# EAGLE design rumpus (EAGLE 7.5.0)
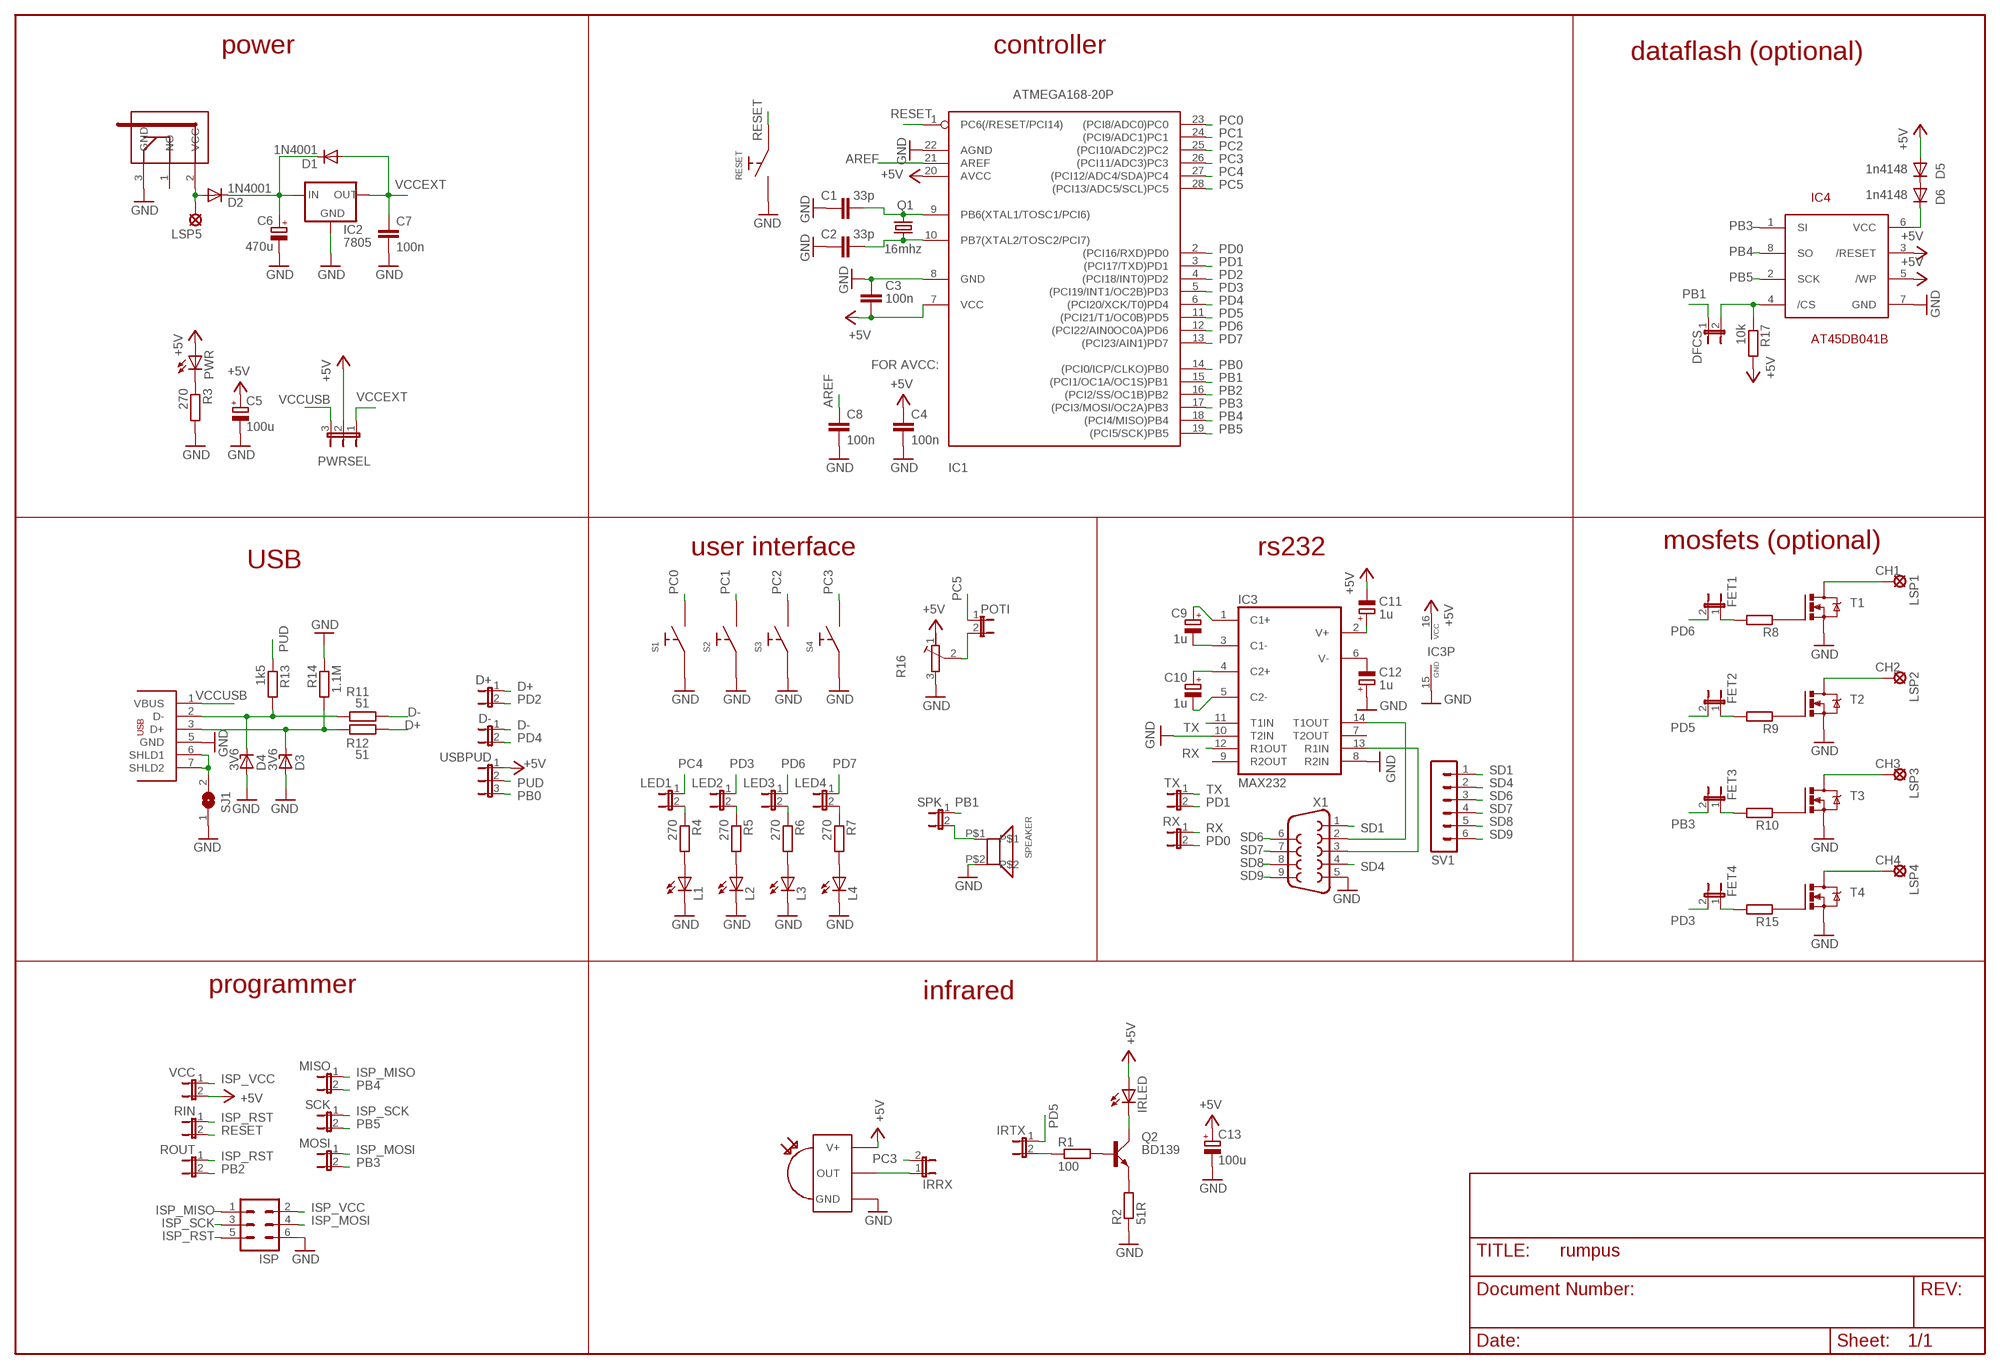
[diagram p0: schematic, sheet 1]

## Parts
C1  33p  C-EU025-024X044  [C025-024X044]
C2  33p  C-EU025-024X044  [C025-024X044]
C3  100n  C-EU025-024X044  [C025-024X044]
C4  100n  C-EU025-024X044  [C025-024X044]
C5  100u  CPOL-EUE2.5-6  [E2,5-6]
C6  470u  CPOL-EUE5-10.5  [E5-10,5]
C7  100n  C-EU025-024X044  [C025-024X044]
C8  100n  C-EU025-024X044  [C025-024X044]
C9  1u  CPOL-EUE2.5-6  [E2,5-6]
C10  1u  CPOL-EUE2.5-6  [E2,5-6]
C11  1u  CPOL-EUE2.5-6  [E2,5-6]
C12  1u  CPOL-EUE2.5-6  [E2,5-6]
C13  100u  CPOL-EUE2.5-6  [E2,5-6]
D1  1N4001  1N4004  [DO41-10]
D2  1N4001  1N4004  [DO41-10]
D3  3V6  ZENER-DIODEZD-2.5  [ZDIO-2.5]
D4  3V6  ZENER-DIODEZD-2.5  [ZDIO-2.5]
D5  1n4148  DIODE-D-2.5  [D-2.5]
D6  1n4148  DIODE-D-2.5  [D-2.5]
D+  JP1E  [JP1]
D-  JP1E  [JP1]
DFCS  JP1E  [JP1]
FET1  JP1E  [JP1]
FET2  JP1E  [JP1]
FET3  JP1E  [JP1]
FET4  JP1E  [JP1]
IC1  ATMEGA168-20P  [DIL28-3]
IC2  7805  78XXS  [78XXS]
IC3  MAX232  [DIL16]
IC4  AT45DB041B  [SOIC8]
IRLED  LED5MM  [LED5MM]
IRRX  JP1E  [JP1]
IRTX  JP1E  [JP1]
ISP  MA03-2  [MA03-2]
L1  LED3MM  [LED3MM]
L2  LED3MM  [LED3MM]
L3  LED3MM  [LED3MM]
L4  LED3MM  [LED3MM]
LED1  JP1E  [JP1]
LED2  JP1E  [JP1]
LED3  JP1E  [JP1]
LED4  JP1E  [JP1]
LSP1  LSP10  [LSP10]
LSP2  LSP10  [LSP10]
LSP3  LSP10  [LSP10]
LSP4  LSP10  [LSP10]
LSP5  LSP10  [LSP10]
MISO  JP1E  [JP1]
MOSI  JP1E  [JP1]
POTI  JP1E  [JP1]
PWR  LED3MM  [LED3MM]
PWRSEL  JP2E  [JP2]
Q1  16mhz  CRYTALHC49U-V  [HC49U-V]
Q2  BD139  [TO126AV]
R1  100  R-EU_0204/2V  [0204V]
R2  51R  R-EU_0204/2V  [0204V]
R3  270  R-EU_0204/7  [0204/7]
R4  270  R-EU_0204/2V  [0204V]
R5  270  R-EU_0204/2V  [0204V]
R6  270  R-EU_0204/2V  [0204V]
R7  270  R-EU_0204/2V  [0204V]
R8  R-EU_0204/2V  [0204V]
R9  R-EU_0204/2V  [0204V]
R10  R-EU_0204/2V  [0204V]
R11  51  R-EU_0204/2V  [0204V]
R12  51  R-EU_0204/2V  [0204V]
R13  1k5  R-EU_0204/2V  [0204V]
R14  1.1M  R-EU_0204/2V  [0204V]
R15  R-EU_0204/2V  [0204V]
R16  R-TRIMMPT6-L  [PT6-L]
R17  10k  R-EU_0204/2V  [0204V]
RESET  MIKROTASTER6X6L  [TASTER3301]
RIN  JP1E  [JP1]
ROUT  JP1E  [JP1]
RX  JP1E  [JP1]
S1  MIKROTASTER6X6L  [TASTER3301]
S2  MIKROTASTER6X6L  [TASTER3301]
S3  MIKROTASTER6X6L  [TASTER3301]
S4  MIKROTASTER6X6L  [TASTER3301]
SCK  JP1E  [JP1]
SJ1  SJ  [SJ]
SPEAKER  BUZZER  [BUZZER]
SPK  JP1E  [JP1]
SV1  MA06-1  [MA06-1]
T1  N-CHANNEL-MOSFET  [TO220BV]
T2  N-CHANNEL-MOSFET  [TO220BV]
T3  N-CHANNEL-MOSFET  [TO220BV]
T4  N-CHANNEL-MOSFET  [TO220BV]
TX  JP1E  [JP1]
U$2  TSOP1738  [TSOP17XX]
U$3  HEBW21  [HEBW21]
USB  USB-SOCKETMINI-B  [USB-BWM]
USBPUD  JP2E  [JP2]
VCC  JP1E  [JP1]
X1  F09HP  [F09HP]

## Nets
+5V: C3.2 C4.1 C5.+ C11.- C13.+ D5.A IC1.7(VCC) IC1.20(AVCC) IC3.16(VCC) IC4.3(/RESET) IC4.5(/WP) IRLED.A PWR.A PWRSEL.2 R16.1(A) R17.2 U$2.V+ USBPUD.1 VCC.2
AREF: C8.1 IC1.21(AREF)
CH1: LSP1.MP T1.D
CH2: LSP2.MP T2.D
CH3: LSP3.MP T3.D
CH4: LSP4.MP T4.D
D+: D+.1 R12.2
D-: D-.1 R11.2
GND: C1.2 C2.2 C3.1 C4.2 C5.- C6.- C7.2 C8.2 C12.+ C13.- D3.A D4.A IC1.8(GND) IC1.22(AGND) IC2.GND IC3.8(R2IN) IC3.10(T2IN) IC3.15(GND) IC4.7(GND) ISP.6 L1.K(C) L2.K(C) L3.K(C) L4.K(C) R2.1 R3.2 R14.1 R16.3(E) RESET.2 S1.1 S2.1 S3.1 S4.1 SJ1.1 SPEAKER.P$2 T1.S T2.S T3.S T4.S U$2.GND U$3.3(GND) USB.5(GND) X1.5
IR_OUT: IRTX.2 R1.1
ISP_MISO: ISP.1 MISO.1
ISP_MOSI: ISP.4 MOSI.1
ISP_RST: ISP.5 RIN.1 ROUT.1
ISP_SCK: ISP.3 SCK.1
ISP_VCC: ISP.2 VCC.1
N$1: D2.A LSP5.MP U$3.2(VCC)
N$2: PWR.K(C) R3.1
N$3: C1.1 IC1.9(PB6(XTAL1/TOSC1/PCI6)) Q1.1
N$4: C6.+ D1.C D2.C IC2.IN
N$5: C2.1 IC1.10(PB7(XTAL2/TOSC2/PCI7)) Q1.2
N$6: L1.A R4.2
N$7: L2.A R5.2
N$8: L3.A R6.2
N$9: L4.A R7.2
N$10: LED1.2 R4.1
N$11: LED2.2 R5.1
N$12: LED3.2 R6.1
N$13: SJ1.2 USB.6(SHLD1) USB.7(SHLD2)
N$14: D3.C R12.1 R14.2 USB.3(D+)
N$15: D4.C R11.1 R13.2 USB.2(D-)
N$16: LED4.2 R7.1
N$17: R8.1 T1.G
N$18: R9.1 T2.G
N$19: R10.1 T3.G
N$20: R15.1 T4.G
N$21: C9.+ IC3.1(C1+)
N$22: C9.- IC3.3(C1-)
N$23: C10.+ IC3.4(C2+)
N$24: C10.- IC3.5(C2-)
N$25: C11.+ IC3.2(V+)
N$26: C12.- IC3.6(V-)
N$27: IC3.13(R1IN) X1.3
N$28: IC3.14(T1OUT) X1.2
N$29: SPEAKER.P$1 SPK.2
N$30: IRRX.1 U$2.OUT
N$31: IRLED.K(C) Q2.C
N$32: Q2.E R2.2
N$33: Q2.B R1.2
N$34: FET1.1 R8.2
N$35: FET2.1 R9.2
N$36: FET3.1 R10.2
N$37: FET4.1 R15.2
N$44: POTI.2 R16.2(S)
N$57: D5.C D6.A
N$58: D6.C IC4.6(VCC)
N$59: DFCS.2 IC4.4(/CS) R17.1
PB0: IC1.14((PCI0/ICP/CLKO)PB0) USBPUD.3
PB1: DFCS.1 IC1.15((PCI1/OC1A/OC1S)PB1) SPK.1
PB2: IC1.16((PCI2/SS/OC1B)PB2) ROUT.2
PB3: FET3.2 IC1.17((PCI3/MOSI/OC2A)PB3) IC4.1(SI) MOSI.2
PB4: IC1.18((PCI4/MISO)PB4) IC4.8(SO) MISO.2
PB5: IC1.19((PCI5/SCK)PB5) IC4.2(SCK) SCK.2
PC0: IC1.23((PCI8/ADC0)PC0) S1.2
PC1: IC1.24((PCI9/ADC1)PC1) S2.2
PC2: IC1.25((PCI10/ADC2)PC2) S3.2
PC3: IC1.26((PCI11/ADC3)PC3) IRRX.2 S4.2
PC4: IC1.27((PCI12/ADC4/SDA)PC4) LED1.1
PC5: IC1.28((PCI13/ADC5/SCL)PC5) POTI.1
PD0: IC1.2((PCI16/RXD)PD0) RX.2
PD1: IC1.3((PCI17/TXD)PD1) TX.2
PD2: D+.2 IC1.4((PCI18/INT0)PD2)
PD3: FET4.2 IC1.5((PCI19/INT1/OC2B)PD3) LED2.1
PD4: D-.2 IC1.6((PCI20/XCK/T0)PD4)
PD5: FET2.2 IC1.11((PCI21/T1/OC0B)PD5) IRTX.1
PD6: FET1.2 IC1.12((PCI22/AIN0OC0A)PD6) LED3.1
PD7: IC1.13((PCI23/AIN1)PD7) LED4.1
PUD: R13.1 USBPUD.2
RESET: IC1.1(PC6(/RESET/PCI14)) RESET.1 RIN.2
RX: IC3.12(R1OUT) RX.1
SD1: SV1.1 X1.1
SD4: SV1.2 X1.4
SD6: SV1.3 X1.6
SD7: SV1.4 X1.7
SD8: SV1.5 X1.8
SD9: SV1.6 X1.9
TX: IC3.11(T1IN) TX.1
VCCEXT: C7.1 D1.A IC2.OUT PWRSEL.1
VCCUSB: PWRSEL.3 USB.1(VBUS)
Unconnected: IC3.7(T2OUT) IC3.9(R2OUT) U$3.1(NO)

## Notes on the sheet
- power | controller | dataflash (optional)
- FOR AVCC:
- user interface | rs232 | mosfets (optional)
- USB
- programmer | infrared

## Library data of the parts
C1-C4 C7 C8 = rcl:C-EU: CAPACITOR, European symbol
C5 C6 C9-C13 = rcl:CPOL-EU: POLARIZED CAPACITOR, European symbol
D1 D2 = diode:1N4004: DIODE general purpose rectifier, 1 A
D3 D4 = diode:ZENER-DIODE: Z-Diode
D5 D6 = diode:DIODE-: DIODE
D+ D- DFCS FET1-FET4 IRRX IRTX LED1-LED4 MISO MOSI POTI RIN ROUT RX SCK SPK TX VCC = small-jumper:JP1E: JUMPER
IC1 = avr:ATMEGA168*P: MICROCONTROLLER 16 kBytes FLASH 1 kBytes SRAM 512 Bytes EEPROM USART 8-channel 10 bit ADC
IC2 = v-reg:78XXS: VOLTAGE REGULATOR
IC3 = maxim:MAX232: RS232 TRANSEIVER
IC4 = atmel-dataflash:AT45DB041B
IRLED L1-L4 PWR = lemonhead-special:LED: LED OSRAM: - CHIPLED LG R971, LG N971, LY N971, LG Q971, LY Q971, LO R971, LY R971 LH N974, LH R974 LS Q976, LO Q976, LY Q976 LO Q996 - Hyper CHIPLED LW Q18S LB Q993, LB Q99A, LB R99A - SideLED LS A670, LO A670, LY A670, LG A670, LP A670 LB A673, LV A673, LT A673, LW A673 LH A674 LY A675 LS A676, LA A676, LO A676, LY A676, LW A676 LS A679, LY A679, LG A679 - Hyper Micro SIDELED® LS Y876, LA Y876, LO Y876, LY Y876 LT Y87S - SmartLED LW L88C, LW L88S LB L89C, LB L89S, LG L890 LS L89K, LO L89K, LY L89K LS L896, LA L896, LO L896, LY L896 - TOPLED LS T670, LO T670, LY T670, LG T670, LP T670 LSG T670, LSP T670, LSY T670, LOP T670, LYG T670 LG T671, LOG T671, LSG T671 LB T673, LV T673, LT T673, LW T673 LH T674 LS T676, LA T676, LO T676, LY T676, LB T676, LH T676, LSB T676, LW T676 LB T67C, LV T67C, LT T67C, LS T67K, LO T67K, LY T67K, LW E67C LS E67B, LA E67B, LO E67B, LY E67B, LB E67C, LV E67C, LT E67C LW T67C LS T679, LY T679, LG T679 LS T770, LO T770, LY T770, LG T770, LP T770 LB T773, LV T773, LT T773, LW T773 LH T774 LS E675, LA E675, LY E675, LS T675 LS T776, LA T776, LO T776, LY T776, LB T776 LHGB T686 LT T68C, LB T68C - Hyper Mini TOPLED® LB M676 - Mini TOPLED Santana® LG M470 LS M47K, LO M47K, LY M47K Source: http://www.osram.convergy.de/
ISP = isp-socket:MA03-2: PIN HEADER
LSP1-LSP5 = solpad:LSP10: SOLDER PAD drill 1.0 mm, distributor Buerklin, 12H555
PWRSEL USBPUD = small-jumper:JP2E: JUMPER
Q1 = crystal:CRYTAL: CRYSTAL
Q2 = transistor-power:BD139: NPN TRANSISTOR
R1-R15 R17 = rcl:R-EU_: RESISTOR, European symbol
R16 = hd44780-pin-header:R-TRIMM: Trimm resistor
RESET S1-S4 = hebw21-extern:MIKROTASTER
SJ1 = small-jumper:SJ: SMD solder JUMPER
SPEAKER = routerboard:BUZZER
SV1 = isp-socket:MA06-1: PIN HEADER
T1-T4 = mosfet-ansteuerung:N-CHANNEL-MOSFET
U$2 = tsop:TSOP1738: IR Receiver and Demodulator
U$3 = hebw21-extern:HEBW21
USB = unzap-misc:USB-SOCKET
X1 = subd09-extern:F09: SUB-D

## Board
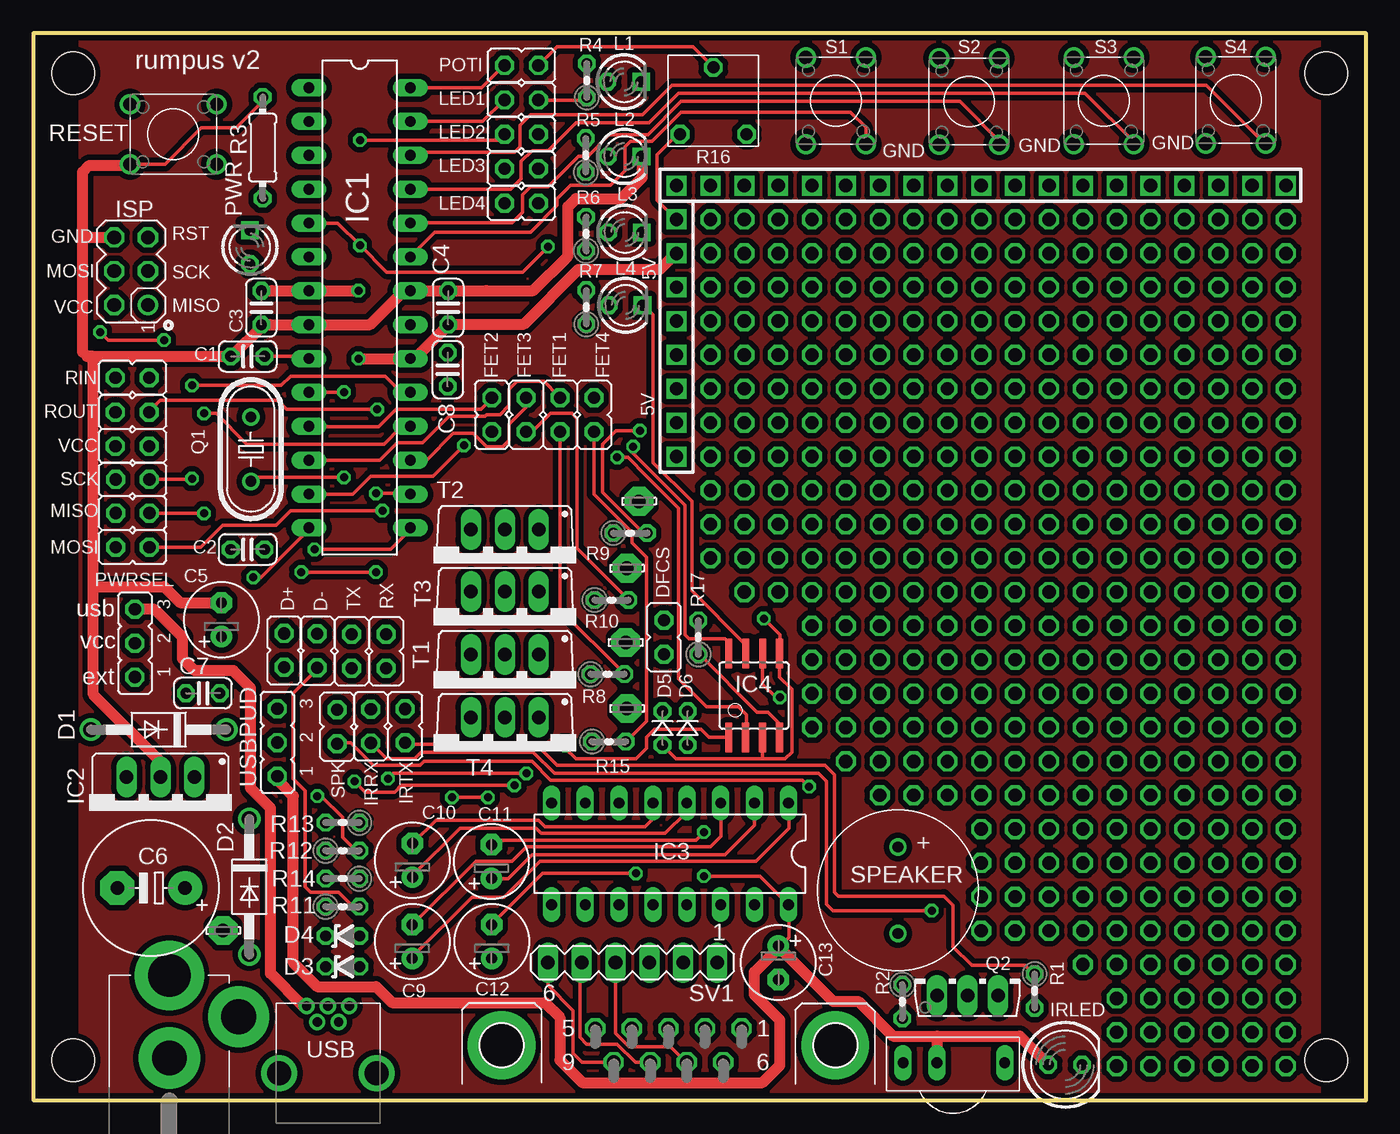
[diagram p1: board, top side]
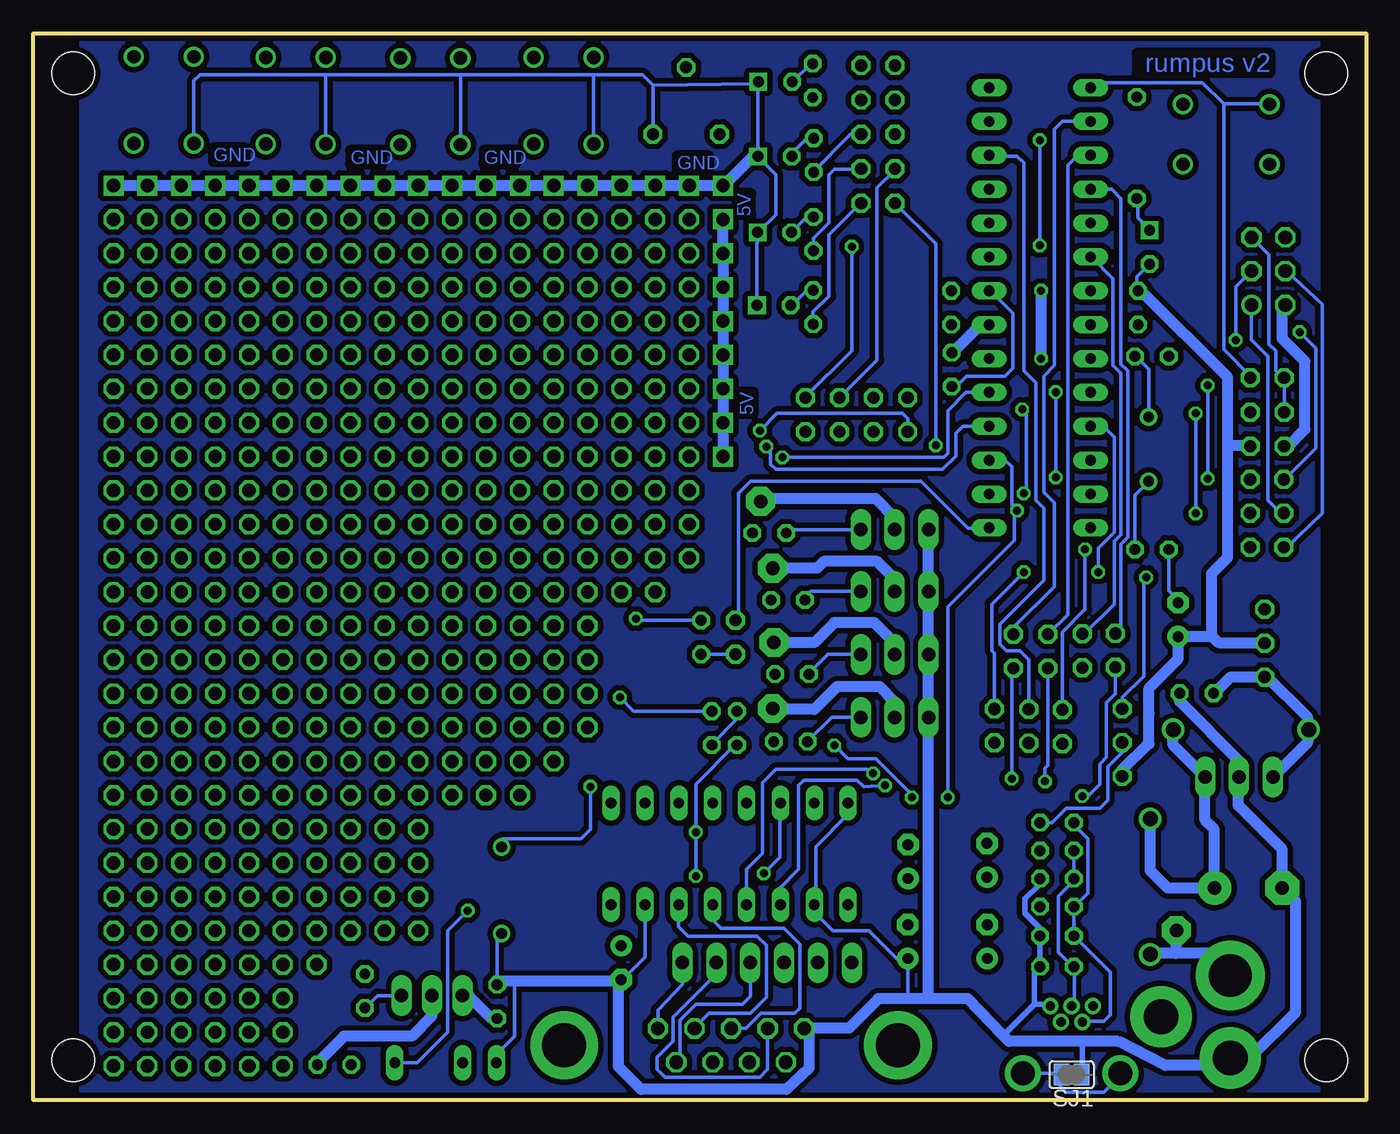
[diagram p2: board, bottom side, seen from below]

Size 100 x 80 mm. Coordinates in mm from the lower left corner, seen from the top.
Outline: 0,0 100,0 100,80 0,80 0,0
Copper layers (1*16): Top 0.035mm / dielectric 1.5mm / Bottom 0.035mm
Design rules "default": minimum track width 10mil, minimum drill 0.3mm, track to track 0.2mm, track to pad 0.2mm, pad to pad 0.2mm, via to via 0.2mm, smd to smd 0.15mm, copper to edge 0.2mm, drill to drill 0.3mm, minimum pad ring 10mil, minimum via ring 8mil, stop-mask expansion 4mil, vias tented up to drill 0mil, thermal gap 10mil
Holes 3.2 mm at 3,77 3,3 97,3 97,77
tRestrict: area 0,0 to 3,80; area 97,0 to 100,80
bRestrict: area 0,0 to 3,80; area 97,0 to 100,80
vRestrict: area 0,0 to 3,80; area 97,0 to 100,80

### Footprints (pad centres in the part's own frame; a part is rotated, then mirrored left to right if it is on the bottom)
C025-024X044 = drill 0.813 octagon: 1 -1.27,0; 2 1.27,0
E2,5-6 = drill 0.813 pad 1.6: + -1.27,0 | drill 0.813 pad 1.6 octagon: - 1.27,0
E5-10,5 = drill 1.016 pad 2.54: + -2.54,0 | drill 1.016 pad 2.54 octagon: - 2.54,0
DO41-10 = drill 1.118: A 5.08,0; C -5.08,0
ZDIO-2.5 = drill 0.813 octagon: A 1.27,0; C -1.27,0
D-2.5 = drill 0.813 octagon: A 1.27,0; C -1.27,0
JP1 = drill 0.914 octagon: 1 0,-1.27; 2 0,1.27
DIL28-3 = drill 0.813 long: 1 -16.51,-3.81; 2 -13.97,-3.81; 3 -11.43,-3.81; 4 -8.89,-3.81; 5 -6.35,-3.81; 6 -3.81,-3.81; 7 -1.27,-3.81; 8 1.27,-3.81; 9 3.81,-3.81; 10 6.35,-3.81; 11 8.89,-3.81; 12 11.43,-3.81; 13 13.97,-3.81; 14 16.51,-3.81; 15 16.51,3.81; 16 13.97,3.81; 17 11.43,3.81; 18 8.89,3.81; 19 6.35,3.81; 20 3.81,3.81; 21 1.27,3.81; 22 -1.27,3.81; 23 -3.81,3.81; 24 -6.35,3.81; 25 -8.89,3.81; 26 -11.43,3.81; 27 -13.97,3.81; 28 -16.51,3.81
78XXS = drill 1.016 long: GND 0,-2.54; IN -2.54,-2.54; OUT 2.54,-2.54
DIL16 = drill 0.813 long: 1 -8.89,-3.81; 2 -6.35,-3.81; 3 -3.81,-3.81; 4 -1.27,-3.81; 5 1.27,-3.81; 6 3.81,-3.81; 7 6.35,-3.81; 8 8.89,-3.81; 9 8.89,3.81; 10 6.35,3.81; 11 3.81,3.81; 12 1.27,3.81; 13 -1.27,3.81; 14 -3.81,3.81; 15 -6.35,3.81; 16 -8.89,3.81
SOIC8 = smd 0.5 x 2.2: 1 -1.905,-3.154; 2 -0.645,-3.154; 3 0.625,-3.154; 4 1.895,-3.154; 5 1.905,3.154; 6 0.635,3.154; 7 -0.635,3.154; 8 -1.905,3.154
LED5MM = drill 0.813 octagon: A -1.27,0; K 1.27,0
MA03-2 = drill 1.016: 1 -2.54,-1.27 | drill 1.016 octagon: 2 -2.54,1.27; 3 0,-1.27; 4 0,1.27; 5 2.54,-1.27; 6 2.54,1.27
LED3MM = drill 0.813 octagon: A -1.27,0 | drill 0.813 square: K 1.27,0
LSP10 = drill 1.016 pad 2.159 octagon: MP 0,0
JP2 = drill 0.914 octagon: 1 -2.54,0; 2 0,0; 3 2.54,0
HC49U-V = drill 0.813: 1 -2.413,0; 2 2.413,0
TO126AV = drill 1.016 long: B 2.286,-1.27; C 0,-1.27; E -2.286,-1.27
0204V = drill 0.813 octagon: 1 -1.27,0; 2 1.27,0
0204/7 = drill 0.813 octagon: 1 -3.81,0; 2 3.81,0
PT6-L = drill 0.9 octagon: 1 -2.5,-2.5; 2 0,2.5; 3 2.5,-2.5
TASTER3301 = drill 1: 1 -3.25,2.25; 2 -3.25,-2.25; 3 3.25,-2.25; 4 3.25,2.25
SJ = smd 1.168 x 1.6: 1 -0.762,0; 2 0.762,0
BUZZER = drill 0.8: P$1 -3.25,0; P$2 3.25,0
MA06-1 = drill 1.016 long: 1 -6.35,0; 2 -3.81,0; 3 -1.27,0; 4 1.27,0; 5 3.81,0; 6 6.35,0
TO220BV = drill 1.016 long: D 0,-2.54; G -2.54,-2.54; S 2.54,-2.54
TSOP17XX = drill 0.813 long: GND -3.81,0; OUT 3.81,0; V+ -1.27,0
HEBW21 = drill 2.6 pad 4.6: 1 0,-5.2; 3 -3.1,0 | drill 3.2 pad 5.2: 2 3.1,0
USB-BWM = drill 0.7: 1 5.05,1.6; 2 3.85,0.8; 3 5.05,0; 4 3.85,-0.8; 5 5.05,-1.6 | drill 1.8: 6 0,3.65; 7 0,-3.65
F09HP = drill 1.016 octagon: 1 -5.486,-1.27; 2 -2.743,-1.27; 3 0,-1.27; 4 2.743,-1.27; 5 5.486,-1.27; 6 -4.115,1.27; 7 -1.372,1.27; 8 1.372,1.27; 9 4.115,1.27 | drill 3.302 pad 5.08: G1 -12.522,0; G2 12.522,0

### Placement (x,y rotation side)
C1  16.08,55.77 180 top
C2  16.08,41.29 180 top
C3  17.11,59.42 90 top
C4  31.13,59.42 90 top
C5  14.11,36.02 90 top
C6  8.84,15.9 180 top
C7  12.72,30.51 0 top
C8  31.09,54.78 270 top
C9  28.43,11.88 90 top
C10  28.45,17.98 90 top
C11  34.37,17.88 90 top
C12  34.39,11.88 90 top
C13  55.9,10.3 270 top
D1  9.4,27.78 180 top
D2  16.2,16 270 top
D3  23.2,10 0 top
D4  23.2,12.3 0 top
D5  47.21,27.89 270 top
D6  49.09,27.89 270 top
D+  18.82,33.72 0 top
D-  21.3,33.7 0 top
DFCS  47.32,34.7 180 top
FET1  39.52,51.39 0 top
FET2  34.4,51.39 0 top
FET3  36.98,51.39 0 top
FET4  42.06,51.39 0 top
IC1  24.48,59.42 270 top
IC2  9.54,21.68 180 top
IC3  47.76,18.46 180 top
IC4  54.08,30.34 0 top
IRLED  77.42,2.64 0 top
IRRX  25.32,28.04 0 top
IRTX  27.9,28.06 180 top
ISP  7.34,62.16 90 top
L1  44.33,76.37 0 top
L2  44.36,70.77 0 top
L3  44.39,65.07 0 top
L4  44.44,59.61 0 top
LED1  36.62,75 270 top
LED2  36.62,72.42 270 top
LED3  36.62,69.84 270 top
LED4  36.62,67.26 270 top
LSP1  44.44,34.32 0 top
LSP2  45.44,44.9 0 top
LSP3  44.54,39.88 0 top
LSP4  44.54,29.36 0 top
LSP5  14.24,12.72 0 top
MISO  7.44,44.02 270 top
MOSI  7.44,41.46 270 top
POTI  36.62,77.59 270 top
PWR  16.25,63.96 90 top
PWRSEL  7.62,34.26 90 top
Q1  16.32,48.81 270 top
Q2  70.09,9.1 0 top
R1  75.12,8.18 270 top
R2  65.2,7.38 270 top
R3  17.21,71.42 90 top
R4  41.53,76.46 90 top
R5  41.45,70.86 90 top
R6  41.47,64.96 90 top
R7  41.49,59.46 90 top
R8  43.08,31.94 0 top
R9  44.78,42.52 0 top
R10  43.38,37.5 0 top
R11  23.2,14.5 0 top
R12  23.2,18.7 0 top
R13  23.2,20.8 180 top
R14  23.2,16.6 180 top
R15  43.18,26.88 0 top
R16  51.02,74.94 0 top
R17  49.9,34.7 90 top
RESET  10.5,72.43 0 top
RIN  7.43,54.16 270 top
ROUT  7.43,51.58 270 top
RX  26.46,33.66 0 top
S1  60.21,74.94 90 top
S2  70.21,74.89 90 top
S3  80.31,74.94 90 top
S4  90.21,74.99 90 top
SCK  7.44,46.54 270 top
SJ1  22.1,1.9 180 bottom
SPEAKER  64.87,15.73 270 top
SPK  22.8,28 180 top
SV1  44.95,10.3 180 top
T1  35.38,30.88 180 top
T2  35.38,40.24 180 top
T3  35.38,35.6 180 top
T4  35.38,26.16 180 top
TX  23.88,33.66 0 top
U$2  69.07,2.79 0 top
U$3  10.2,6.24 90 top
USB  22.1,2 90 top
USBPUD  18.31,26.81 90 top
VCC  7.43,49.04 270 top
X1  47.65,4.1 180 top

### Tracks (layer width: path | path; a pad name or v marks a point on that pad's centre or on a via)
+5V  (via drill 0.6, 1)
  Top 0.254: C11.- 34.37,19.17 34.7,19.5 49.7,19.5 v50.3,20.1 | v50.3,16.8 54.5,16.8 IC3.16 56.7,14.6 56.7,12.2 56,11.5 | R16.1 48.34,72.44 46.8,70.9 46.8,67.5 v48.26,66.04 48.3,66 | IC4.3 | IC4.3 54.7,27.9 | D5.A 47.21,26.6 47.2,26.6 48.2,25.6 54.7,25.6 | 54.7,25.6 56.4,25.6 56.9,26.1 56.9,30.8 55.98,31.71 IC4.5 55.98,33.6 56,33.6 56,34.9 v54.8,36.1 | 54.7,25.6 IC4.3
  Top 0.813: USBPUD.1 18.37,23.93 19.5,22.8 19.5,10.3 21.3,8.5 25.7,8.5 26.9,7.3 38.4,7.3 39.5,6.2 39.5,3 41.2,1.3 54.7,1.3 56,2.6 56,6 54.1,7.9 54.1,9.6 55.9,11.4 C13.+ | C13.+ 55.93,11.37 56,11.5 55.97,11.47 C13.+ | C13.+ 55.93,11.47 | IRLED.A 74,4.8 67.8,4.8 | 67.8,4.8 U$2.V+ | 17.9,60.7 17.89,60.69 C3.2 20.49,60.69 20.5,60.7 20.51,60.69 IC1.7 v24.39,60.69 v24.4,60.7 | v24.4,55.6 IC1.20 28.61,55.61 31.15,58.15 | 31.15,58.15 31.2,58.2 | 31.15,58.15 C4.1 31.13,58.2 | 31.13,58.2 31.1,58.2 | v48.26,63.5 48.26,63.6 48.3,63.6 47,62.3 40.9,62.3 36.8,58.2 31.13,58.2 | C13.+ 55.9,11.5 60,7.4 61.9,7.4 64.5,4.8 67.8,4.8
  Bottom 0.254: 16.3,29 16.45,28.85 | v50.3,16.8 v50.3,20.1 50.3,23.7 47.4,26.6 47.4,26.62 D5.A | R17.2 54.67,35.97 v54.8,36.1 | C3.2 17.2,60.7 17.2,61.74 PWR.A
  Bottom 0.813: USBPUD.1 18.3,24.79 18.3,24.8 16.4,26.7 16.3,26.7 16.3,29 16.3,30.9 14.1,33.1 14.1,34.8 14.11,34.8 C5.+ | 14,34.8 C5.+ | PWRSEL.2 7.7,34.26 7.7,34.3 11.1,34.3 11.6,34.8 | 14,34.8 14.05,34.75 C5.+ | 14,34.8 11.6,34.8 | 8.7,49.1 VCC.2 | 8.7,49.1 8.8,49 | 11.6,34.8 11.6,39.5 10.4,40.7 10.4,49.1 | 10.4,49.1 10.4,54.2 16.89,60.69 C3.2 | 10.4,49.1 8.7,49.1 | v24.4,60.7 v24.4,55.6 | v48.26,66.04 v48.26,63.5 v48.26,60.96 v48.26,58.42 v48.26,55.88 v48.26,53.34 v48.26,50.8 v48.26,48.26
AREF
  Bottom 0.813: 31.09,56.01 31.1,56 | 31.09,56.01 C8.1 | IC1.21 28.95,58.15 31.09,56.01
CH1
  Bottom 0.813: T1.D 35.38,34.28 36.9,35.8 39.9,35.8 41.4,34.3 44.5,34.3 44.48,34.32 LSP1.MP
CH2
  Bottom 0.813: T2.D 35.38,43.68 36.8,45.1 44.7,45.1 45.3,44.9 LSP2.MP
CH3
  Bottom 0.813: T3.D 35.38,39.08 36.7,40.4 40.7,40.4 41.2,39.9 44.4,39.9 44.42,39.88 LSP3.MP
CH4
  Bottom 0.813: T4.D 35.38,29.88 36.5,31 39.7,31 41.4,29.3 44.4,29.3 44.5,29.4 LSP4.MP
D+  (via drill 0.6)
  Top 0.254: R12.2 24.2,18.7 23.2,19.7 23.2,21.2 21.6,22.8 v21.3,22.8
  Bottom 0.254: D+.1 18.82,30.48 19.5,29.8 19.5,25.7 20,25.2 20,23.7 20.9,22.8 v21.3,22.8
D-
  Top 0.254: R11.2 24,14.5 22.9,15.6 20.8,15.6 20.4,16 20.4,23.2 19.5,24.1 19.5,30.5 21.3,32.3 D-.1
GND  (via drill 1)
  Top 0.254: RESET.2 9.88,70.18 12.6,72.9 15.2,72.9 17.03,74.73 | 17.03,74.73 17.1,74.8 | 17.03,74.73 R3.2 | IC4.7 53.45,34.16 49.4,38.2 49.4,44.9 46.5,47.8 46.5,58.9 45.8,59.6 45.8,59.61 L4.K
  Top 0.813: IC2.GND 9.54,25.36 4.5,30.4 4.5,38.5 | C5.- 13.9,37.29 13.9,37.3 11,37.3 9.8,38.5 4.5,38.5 | 3.7,64.7 3.7,56.1 4.03,55.77 4.5,55.77 | 3.7,64.7 3.7,69.6 4.2,70.1 7.2,70.1 7.28,70.28 RESET.2 | 3.7,64.7 ISP.6 | 4.5,55.77 14.87,55.77 | 4.5,38.5 4.5,55.77 | 14.87,55.77 C1.2 | 14.87,55.77 17.3,58.2 17.75,58.15 C3.1 20.55,58.15 20.6,58.1 20.65,58.15 IC1.8 25.25,58.15 27.8,60.7 28.21,60.69 IC1.22 30.99,60.69 31,60.7 31.01,60.69 C4.2 33.99,60.69 33.99,60.7 37.5,60.7 40.1,63.3 40.1,67 40.7,67.6 44.1,67.6 45.7,69.2 45.7,70.7 45.63,70.8 L2.K | L4.K
  Bottom 0.254: D4.A 24.5,12.3 24.47,12.27 | 21.3,2.5 21.44,2.3 SJ1.1 | 24.5,9.9 24.47,9.9 D3.A | 42.16,5.4 42.1,5.3 | 34.5,7.6 34.39,7.71 C12.+ 35.21,10.61 37.3,12.7 40,12.7 41.4,14.1 41.4,14.6 41.41,14.6 IC3.10 41.3,14.7 41.3,19 38.87,21.43 IC3.8 | C5.- 14.01,37.29 14,37.3 14.81,38.21 C2.2 | C8.2 30.79,53.51 30,54.3 27.1,54.3 26.5,54.9 26.5,59 28.2,60.7 28.21,60.69 IC1.22 | L4.K 45.71,64.29 45.66,64.34 L3.K 45.63,65.07 44.3,66.4 44.3,69.4 45.6,70.7 45.63,70.7 L2.K | L2.K 45.73,70.47 45.8,70.4 45.66,70.26 | L1.K 45.6,76.3 45.63,76.27 L2.K | L2.K 45.63,70.53 45.8,70.7 | S4.1 87.96,76.44 87.5,76.9 78.1,76.9 | 45.7,76.3 45.67,76.27 L1.K | 57.9,76.9 67.9,76.9 | 67.9,76.9 78.1,76.9 | S1.1 57.96,76.84 57.9,76.9 | S2.1 67.96,76.84 67.9,76.9 | S3.1 78.06,76.86 78.1,76.9 | L1.K 45.67,76.37 | v53.34,68.58 53.42,68.58 53.5,68.5 53.52,68.52 | 45.7,76.3 45.63,76.37 L1.K | 45.7,76.3 45.8,76.2 53.5,76.1 | 57.9,76.9 54.3,76.9 53.5,76.1 | R16.3 53.52,76.08 53.5,76.1 | C13.- 55.9,8.9 54.11,10.69 IC3.15 | U$2.GND 65.26,3.44 63.9,4.8 63.9,8.9 | SPEAKER.P$2 65.2,12.15 65.2,8.7
  Bottom 0.406: D3.A 24.47,12.27 | 24.5,9.9 24.9,9.5 24.9,7.2 | D4.A 24.47,12.87 25.6,14 25.6,15.1 24.5,16.2 R14.1 | 21.3,4.4 21.3,2.5 | 33.8,7.6 33.8,7.8 33.81,7.81 | 27.25,4.85 27.25,4.9 27.3,4.8 24.9,7.2 | USB.5 23.7,7 23.9,7.2 24.9,7.2
  Bottom 0.813: C7.2 13.99,30.4 13.9,30.3 14,30.2 14,29.9 9.4,25.3 9.4,24.3 9.5,24.2 9.5,24.22 IC2.GND 9.54,24.1 9.5,24.1 9.6,24 9.6,22.1 6.3,18.8 C6.- 5.3,14.9 5.3,6.6 8.76,3.14 U$3.3 10.74,2.6 15.1,2.6 18.6,4.4 21.3,4.4 26.8,4.4 27.25,4.85 29.9,7.6 32.8,7.6 | 42,5.5 42.1,5.37 X1.5 | X1.5 42.16,5.4 38.8,5.4 36.6,7.6 34.5,7.6 33.8,7.6 32.8,7.6 | X1.5 42.16,5.3 42.2,5.3 41.8,4.9 41.8,2.4 43.5,0.8 54.4,0.8 56.1,2.5 56.1,8.9 | C13.- 55.87,8.93 55.9,8.9 56.1,8.9 | C13.- 55.9,9 55.89,9.01 | 32.8,7.6 32.84,7.64 T4.S T1.S | T1.S 32.84,33.56 32.8,33.6 | T1.S T3.S | T3.S 32.84,38.16 32.8,38.2 | 32.84,42.86 T2.S | T3.S 32.84,42.86 | 32.84,42.86 32.8,42.9 | v93.98,68.58 v91.44,68.58 v88.9,68.58 v86.36,68.58 v83.82,68.58 v81.28,68.58 v78.74,68.58 v76.2,68.58 v73.66,68.58 v71.12,68.58 v68.58,68.58 v66.04,68.58 v63.5,68.58 v60.96,68.58 v58.42,68.58 v55.88,68.58 v53.34,68.58 v50.8,68.58 v48.26,68.58 48.22,68.58 46.1,70.7 46,70.77 L2.K | 56.1,8.9 56.1,8.93 C13.- | R2.1 65.2,8.7 65.2,8.8 65.1,8.9 63.9,8.9 56.1,8.9
IR_OUT
  Top 0.254: R1.1 75.05,9.45 74.4,10.1 70.4,10.1 69,11.5 69,14.6 68.3,15.3 60.4,15.3 60.1,15.6 60.1,24.4 59.4,25.1 39.3,25.1 37.7,26.7 27.8,26.7 IRTX.2
ISP_MISO
  Bottom 0.254: ISP.1 8.61,57.01 7.4,55.8 7.4,45 6.3,43.9 6.28,43.92 MISO.1
ISP_MOSI
  Bottom 0.254: ISP.4 5.96,62.16 3.3,59.7 3.3,44 6.1,41.3 6.16,41.36 MOSI.1
ISP_RST
  Bottom 0.254: ISP.5 7.3,63.39 7.3,56.7 6.8,56.2 6.8,54.7 6.2,54.1 | 6.2,54.1 6.16,54.14 RIN.1 | ROUT.1 6.16,54.06 6.2,54.1
ISP_SCK  (via drill 0.6)
  Top 0.254: v9.8,57 5.6,57 v5,57.6
  Bottom 0.254: ISP.3 8.64,62.16 9.8,61 v9.8,57 | 6.2,46.4 6.17,46.43 SCK.1 6.17,46.47 6.2,46.5 3.8,48.9 3.8,56.4 v5,57.6
ISP_VCC
  Bottom 0.813: VCC.1 5.86,49.04 4.6,50.3 4.6,55.4 6.3,57.1 6.3,59.2 6,59.5 6.07,59.57 ISP.2
N$1
  Bottom 0.813: 16.2,10.9 D2.A 16.2,11 14.3,11 | U$3.2 11.86,11 14.3,11 | LSP5.MP 14.24,11.06 14.3,11
N$2
  Bottom 0.254: PWR.K 17.15,66.15 17.15,67.65 17.3,67.8 17.29,67.81 R3.1
N$3
  Top 0.254: IC1.9 20.67,55.67 20.7,55.7 20.63,55.77 C1.1
  Bottom 0.254: C1.1 17.33,55.77 17.3,55.8 16.32,54.82 Q1.1
N$4
  Bottom 0.813: D2.C 16.2,17.2 14.9,15.9 C6.+ 11.3,15.8 11.4,15.9 11.4,20.3 12.1,21 12.1,24.3 12.08,24.3 IC2.IN 14.5,26.64 14.5,27.8 D1.C
N$5  (via drill 0.6)
  Top 0.254: IC1.10 22.97,53.07 v23.3,53.1 | Q1.2 16.4,46.4 16.7,46.7 v23.3,46.7
  Bottom 0.254: v23.3,46.7 v23.3,53.1 | Q1.2 16.32,46.38 17.35,45.35 C2.1
N$6
  Bottom 0.254: L1.A 43.03,76.37 41.67,77.73 R4.2
N$7
  Bottom 0.254: L2.A 43.09,70.79 43.2,70.9 41.97,72.13 R5.2
N$8
  Bottom 0.254: L3.A 41.97,66.23 R6.2
N$9
  Bottom 0.254: L4.A 43.11,59.61 43.1,59.6 41.97,60.73 R7.2
N$10
  Top 0.254: R4.1 41.53,75.1 41.5,75.1 41.4,75 LED1.2
N$11
  Bottom 0.254: R5.1 41.5,69.59 41.5,69.6 38.68,72.42 LED2.2
N$12
  Bottom 0.254: R6.1 41.47,64.63 40.3,65.8 40.3,69.4 39.9,69.8 37.9,69.8 37.8,69.9 LED3.2
N$13
  Bottom 0.254: 23.2,1.9 SJ1.2 23.3,2 | 23.3,2 USB.7 | USB.6 18.3,2 19.7,0.6 22.5,0.6 23.2,1.3 23.2,1.9 | 23.2,1.9 23.3,2
N$14
  Bottom 0.254: R12.1 21.9,18.7 21.93,18.67 R14.2 21.9,16.5 23.1,15.3 23.1,11.1 22,10 D3.C 21.93,9.9 21.9,9.9 21.9,7.4 22.15,7.05 USB.3
N$15
  Bottom 0.254: D4.C 22,12.3 | D4.C 21.93,14.37 21.9,14.4 21.93,14.4 R11.1 21.9,14.5 20.9,15.5 20.9,19.6 21.93,20.63 R13.2 | USB.2 21.7,5.9 19.7,5.9 19.2,6.4 19.2,9.6 21.9,12.3 D4.C
N$16
  Bottom 0.254: R7.1 41.49,59.11 40.3,60.3 40.3,64.9 37.9,67.3 37.89,67.3 LED4.2
N$17
  Bottom 0.254: R8.1 41.81,31.99 40.38,33.42 T1.G
N$18
  Bottom 0.254: R9.1 43.51,42.5 43.5,42.5 43.22,42.78 T2.G
N$19
  Bottom 0.254: R10.1 42.11,37.69 41.66,38.14 T3.G
N$20
  Bottom 0.254: R15.1 40.1,28.7 T4.G
N$21
  Top 0.254: C9.+ 28.43,10.73 32.9,15.2 35.3,15.2 38,17.9 54.2,17.9 56.7,20.4 56.7,22.2 56.65,22.25 IC3.1 56.67,22.27 56.7,22.3
N$22
  Top 0.254: IC3.3 51.57,21.27 51.6,21.3 51.6,19.8 50.8,19 37,19 35.9,17.9 33.2,17.9 28.43,13.13 | 28.43,13.13 28.4,13.1 | C9.- 28.43,13.13
N$23
  Top 0.254: C10.+ 28.45,16.85 32,20.4 37.7,20.4 38.1,20 47.4,20 49,21.6 49,22.2 49.03,22.23 IC3.4
N$24
  Top 0.254: IC3.5 46.49,22.21 46.5,22.2 46.5,21.1 45.9,20.5 38.4,20.5 37.9,21 30.2,21 C10.-
N$25
  Top 0.254: C11.+ 34.39,16.61 34.4,16.6 35.6,16.6 37.4,18.4 51.9,18.4 54.1,20.6 54.1,21.3 54.11,21.31 IC3.2
N$26  (via drill 0.6)
  Top 0.254: C12.- 34.39,13.19 38.2,17 v45.2,17
  Bottom 0.254: IC3.6 43.95,22.25 44,22.2 44,18.2 v45.2,17
N$27
  Bottom 0.254: IC3.13 48.95,14.65 48.9,14.6 49,14.5 49,13.5 48.4,12.9 43.7,12.9 42.5,11.7 42.5,6.9 42.9,6.5 45.4,6.5 46.53,5.37 X1.3
N$28
  Bottom 0.254: IC3.14 51.57,14.53 51.6,14.5 51.6,13 50.9,12.3 45.7,12.3 45,11.6 45,7.7 46.2,6.5 49.3,6.5 50.4,5.4 50.39,5.4 X1.2
N$29  (via drill 0.6)
  Top 0.254: v58.2,23.5 57.7,24 38.8,24 37.4,25.4 29.3,25.4 29,25.1 25.5,25.1 23.8,26.8 23,26.8 22.9,26.7 22.87,26.73 SPK.2
  Bottom 0.254: 22.9,26.8 22.83,26.73 SPK.2 | v58.2,23.5 58.2,20.3 58.9,19.6 64.8,19.6 SPEAKER.P$1 64.9,19.5
N$30  (via drill 0.6)
  Top 0.254: v67.4,14.2 60,14.2 59.5,14.7 59.5,23.9 58.9,24.5 39.1,24.5 37.5,26.1 29.1,26.1 28.6,25.6 26.5,25.6 IRRX.1 | 25.3,26.7 25.32,26.72 IRRX.1 | IRRX.1 25.3,26.8
  Bottom 0.254: v67.4,14.2 68.9,12.7 68.9,5.1 71.2,2.8 72.9,2.8 73,2.7 72.9,2.79 U$2.OUT
N$31
  Bottom 0.813: Q2.C 70.09,6.31 71.6,4.8 76.7,4.8 78.8,2.7 78.49,2.69 IRLED.K
N$32
  Bottom 0.813: Q2.E 67.27,7.83 67.3,7.8 65.61,6.11 R2.2
N$33
  Bottom 0.254: R1.2 75.1,6.9 74.17,7.83 Q2.B
N$34
  Top 0.254: R8.2 44.35,32 44.3,32 39.52,36.78 FET1.1
N$35  (via drill 0.6)
  Top 0.254: 45.9,42.52 45.9,42.5 | 45.9,42.52 45.6,42.7 42.7,45.6 42.7,49.2 43.7,50.2 v45.5,50.2 | 45.9,42.52 R9.2
  Bottom 0.254: FET2.1 34.4,51.1 34.8,51.5 44.2,51.5 v45.5,50.2
N$36
  Top 0.254: FET3.1 37.42,50.12 38.8,51.5 40.4,51.5 40.8,51.1 40.8,41.4 44.7,37.5 R10.2
N$37
  Top 0.254: FET4.1 42.06,45.44 44.9,42.6 44.9,41.8 46,40.7 46,28.4 44.5,26.9 44.5,26.88 R15.2
N$38  (via drill 1)
  other vias: 63.5,66.04
N$39  (via drill 1)
  other vias: 66.04,66.04
N$40  (via drill 1)
  other vias: 68.58,66.04
N$41  (via drill 1)
  other vias: 71.12,66.04
N$42  (via drill 1)
  other vias: 73.66,66.04
N$43  (via drill 1)
  other vias: 76.2,66.04
N$44
  Top 0.254: POTI.2 39.3,79 49.5,79 51,77.5 51.02,77.5 R16.2
N$45  (via drill 1)
  other vias: 50.8,66.04
N$46  (via drill 1)
  other vias: 53.34,66.04
N$47  (via drill 1)
  other vias: 55.88,66.04
N$48  (via drill 1)
  other vias: 58.42,66.04
N$49  (via drill 1)
  other vias: 60.96,66.04
N$50  (via drill 1)
  other vias: 78.74,66.04
N$51  (via drill 1)
  other vias: 81.28,66.04
N$52  (via drill 1)
  other vias: 83.82,66.04
N$53  (via drill 1)
  other vias: 86.36,66.04
N$54  (via drill 1)
  other vias: 88.9,66.04
N$55  (via drill 1)
  other vias: 91.44,66.04
N$56  (via drill 1)
  other vias: 93.98,66.04
N$57
  Bottom 0.254: D6.A 49.09,26.7 49.1,26.7 47.21,28.59 D5.C
N$58  (via drill 0.6)
  Top 0.254: v56,30.2 55.7,30.2 54.7,31.2 54.7,33.4 54.72,33.4 IC4.6
  Bottom 0.254: D6.C 54.96,29.16 v56,30.2
N$59
  Top 0.254: R17.1 49.97,33.43 54.3,29.1 55.1,29.1 56,28.2 56,27.19 IC4.4
  Bottom 0.254: R17.1 49.9,33.5 49.83,33.43 DFCS.2
N$60  (via drill 1)
  other vias: 50.8,43.18
N$61  (via drill 1)
  other vias: 50.8,40.64
N$62  (via drill 1)
  other vias: 50.8,63.5
N$63  (via drill 1)
  other vias: 53.34,63.5
N$64  (via drill 1)
  other vias: 55.88,63.5
N$65  (via drill 1)
  other vias: 58.42,63.5
N$66  (via drill 1)
  other vias: 60.96,63.5
N$67  (via drill 1)
  other vias: 63.5,63.5
N$68  (via drill 1)
  other vias: 66.04,63.5
N$69  (via drill 1)
  other vias: 68.58,63.5
N$70  (via drill 1)
  other vias: 71.12,63.5
N$71  (via drill 1)
  other vias: 73.66,63.5
N$72  (via drill 1)
  other vias: 76.2,63.5
N$73  (via drill 1)
  other vias: 78.74,63.5
N$74  (via drill 1)
  other vias: 81.28,63.5
N$75  (via drill 1)
  other vias: 83.82,63.5
N$76  (via drill 1)
  other vias: 86.36,63.5
N$77  (via drill 1)
  other vias: 88.9,63.5
N$78  (via drill 1)
  other vias: 91.44,63.5
N$79  (via drill 1)
  other vias: 93.98,63.5
N$81  (via drill 1)
  other vias: 50.8,60.96
N$82  (via drill 1)
  other vias: 53.34,60.96
N$83  (via drill 1)
  other vias: 55.88,60.96
N$84  (via drill 1)
  other vias: 58.42,60.96
N$85  (via drill 1)
  other vias: 60.96,60.96
N$86  (via drill 1)
  other vias: 63.5,60.96
N$87  (via drill 1)
  other vias: 66.04,60.96
N$88  (via drill 1)
  other vias: 71.12,60.96
N$89  (via drill 1)
  other vias: 68.58,60.96
N$90  (via drill 1)
  other vias: 73.66,60.96
N$91  (via drill 1)
  other vias: 76.2,60.96
N$92  (via drill 1)
  other vias: 78.74,60.96
N$93  (via drill 1)
  other vias: 81.28,60.96
N$94  (via drill 1)
  other vias: 83.82,60.96
N$95  (via drill 1)
  other vias: 86.36,60.96
N$96  (via drill 1)
  other vias: 88.9,60.96
N$97  (via drill 1)
  other vias: 91.44,60.96
N$98  (via drill 1)
  other vias: 93.98,60.96
N$100  (via drill 1)
  other vias: 53.34,58.42
N$101  (via drill 1)
  other vias: 50.8,58.42
N$102  (via drill 1)
  other vias: 55.88,58.42
N$103  (via drill 1)
  other vias: 58.42,58.42
N$104  (via drill 1)
  other vias: 60.96,58.42
N$105  (via drill 1)
  other vias: 63.5,58.42
N$106  (via drill 1)
  other vias: 68.58,58.42
N$107  (via drill 1)
  other vias: 66.04,58.42
N$108  (via drill 1)
  other vias: 71.12,58.42
N$109  (via drill 1)
  other vias: 73.66,58.42
N$110  (via drill 1)
  other vias: 76.2,58.42
N$111  (via drill 1)
  other vias: 78.74,58.42
N$112  (via drill 1)
  other vias: 81.28,58.42
N$113  (via drill 1)
  other vias: 83.82,58.42
N$114  (via drill 1)
  other vias: 86.36,58.42
N$115  (via drill 1)
  other vias: 88.9,58.42
N$116  (via drill 1)
  other vias: 91.44,58.42
N$117  (via drill 1)
  other vias: 93.98,58.42
N$119  (via drill 1)
  other vias: 50.8,55.88
N$120  (via drill 1)
  other vias: 53.34,55.88
N$121  (via drill 1)
  other vias: 55.88,55.88
N$122  (via drill 1)
  other vias: 58.42,55.88
N$123  (via drill 1)
  other vias: 60.96,55.88
N$124  (via drill 1)
  other vias: 63.5,55.88
N$125  (via drill 1)
  other vias: 66.04,55.88
N$126  (via drill 1)
  other vias: 68.58,55.88
N$127  (via drill 1)
  other vias: 71.12,55.88
N$128  (via drill 1)
  other vias: 73.66,55.88
N$129  (via drill 1)
  other vias: 78.74,55.88
N$130  (via drill 1)
  other vias: 76.2,55.88
N$131  (via drill 1)
  other vias: 81.28,55.88
N$132  (via drill 1)
  other vias: 86.36,55.88
N$133  (via drill 1)
  other vias: 83.82,55.88
N$134  (via drill 1)
  other vias: 88.9,55.88
N$135  (via drill 1)
  other vias: 91.44,55.88
N$136  (via drill 1)
  other vias: 93.98,55.88
N$153  (via drill 1)
  other vias: 53.34,53.34
N$154  (via drill 1)
  other vias: 55.88,53.34
N$155  (via drill 1)
  other vias: 58.42,53.34
N$156  (via drill 1)
  other vias: 60.96,53.34
N$157  (via drill 1)
  other vias: 63.5,53.34
N$158  (via drill 1)
  other vias: 66.04,53.34
N$159  (via drill 1)
  other vias: 68.58,53.34
N$160  (via drill 1)
  other vias: 71.12,53.34
N$161  (via drill 1)
  other vias: 53.34,50.8
N$162  (via drill 1)
  other vias: 55.88,50.8
N$163  (via drill 1)
  other vias: 58.42,50.8
N$164  (via drill 1)
  other vias: 60.96,50.8
N$165  (via drill 1)
  other vias: 63.5,50.8
N$166  (via drill 1)
  other vias: 66.04,50.8
N$167  (via drill 1)
  other vias: 68.58,50.8
N$168  (via drill 1)
  other vias: 71.12,50.8
N$169  (via drill 1)
  other vias: 53.34,48.26
N$170  (via drill 1)
  other vias: 55.88,48.26
N$171  (via drill 1)
  other vias: 58.42,48.26
N$172  (via drill 1)
  other vias: 60.96,48.26
N$173  (via drill 1)
  other vias: 63.5,48.26
N$174  (via drill 1)
  other vias: 66.04,48.26
N$175  (via drill 1)
  other vias: 68.58,48.26
N$176  (via drill 1)
  other vias: 71.12,48.26
N$177  (via drill 1)
  other vias: 55.88,45.72
N$178  (via drill 1)
  other vias: 53.34,45.72
N$179  (via drill 1)
  other vias: 58.42,45.72
N$180  (via drill 1)
  other vias: 60.96,45.72
N$181  (via drill 1)
  other vias: 63.5,45.72
N$182  (via drill 1)
  other vias: 66.04,45.72
N$183  (via drill 1)
  other vias: 71.12,45.72
N$184  (via drill 1)
  other vias: 68.58,45.72
N$185  (via drill 1)
  other vias: 53.34,43.18
N$186  (via drill 1)
  other vias: 55.88,43.18
N$187  (via drill 1)
  other vias: 58.42,43.18
N$188  (via drill 1)
  other vias: 60.96,43.18
N$189  (via drill 1)
  other vias: 63.5,43.18
N$190  (via drill 1)
  other vias: 66.04,43.18
N$191  (via drill 1)
  other vias: 68.58,43.18
N$192  (via drill 1)
  other vias: 71.12,43.18
N$193  (via drill 1)
  other vias: 76.2,53.34
N$194  (via drill 1)
  other vias: 78.74,53.34
N$195  (via drill 1)
  other vias: 81.28,53.34
N$196  (via drill 1)
  other vias: 83.82,53.34
N$197  (via drill 1)
  other vias: 86.36,53.34
N$198  (via drill 1)
  other vias: 88.9,53.34
N$199  (via drill 1)
  other vias: 91.44,53.34
N$200  (via drill 1)
  other vias: 93.98,53.34
N$201  (via drill 1)
  other vias: 76.2,50.8
N$202  (via drill 1)
  other vias: 78.74,50.8
N$203  (via drill 1)
  other vias: 81.28,50.8
N$204  (via drill 1)
  other vias: 83.82,50.8
N$205  (via drill 1)
  other vias: 86.36,50.8
N$206  (via drill 1)
  other vias: 88.9,50.8
N$207  (via drill 1)
  other vias: 91.44,50.8
N$208  (via drill 1)
  other vias: 93.98,50.8
N$209  (via drill 1)
  other vias: 76.2,48.26
N$210  (via drill 1)
  other vias: 78.74,48.26
N$211  (via drill 1)
  other vias: 81.28,48.26
N$212  (via drill 1)
  other vias: 83.82,48.26
N$213  (via drill 1)
  other vias: 86.36,48.26
N$214  (via drill 1)
  other vias: 88.9,48.26
N$215  (via drill 1)
  other vias: 91.44,48.26
N$216  (via drill 1)
  other vias: 93.98,48.26
N$217  (via drill 1)
  other vias: 78.74,45.72
N$218  (via drill 1)
  other vias: 76.2,45.72
N$219  (via drill 1)
  other vias: 81.28,45.72
N$220  (via drill 1)
  other vias: 83.82,45.72
N$221  (via drill 1)
  other vias: 86.36,45.72
N$222  (via drill 1)
  other vias: 88.9,45.72
N$223  (via drill 1)
  other vias: 93.98,45.72
N$224  (via drill 1)
  other vias: 91.44,45.72
N$225  (via drill 1)
  other vias: 76.2,43.18
N$226  (via drill 1)
  other vias: 78.74,43.18
N$227  (via drill 1)
  other vias: 81.28,43.18
N$228  (via drill 1)
  other vias: 83.82,43.18
N$229  (via drill 1)
  other vias: 86.36,43.18
N$230  (via drill 1)
  other vias: 88.9,43.18
N$231  (via drill 1)
  other vias: 91.44,43.18
N$232  (via drill 1)
  other vias: 93.98,43.18
N$233  (via drill 1)
  other vias: 50.8,50.8
N$234  (via drill 1)
  other vias: 50.8,53.34
N$235  (via drill 1)
  other vias: 50.8,48.26
N$236  (via drill 1)
  other vias: 50.8,45.72
N$237  (via drill 1)
  other vias: 73.66,53.34
N$238  (via drill 1)
  other vias: 73.66,48.26
N$239  (via drill 1)
  other vias: 73.66,50.8
N$240  (via drill 1)
  other vias: 73.66,43.18
N$241  (via drill 1)
  other vias: 73.66,45.72
N$242  (via drill 1)
  other vias: 53.34,40.64
N$243  (via drill 1)
  other vias: 55.88,40.64
N$244  (via drill 1)
  other vias: 58.42,40.64
N$245  (via drill 1)
  other vias: 60.96,40.64
N$246  (via drill 1)
  other vias: 63.5,40.64
N$247  (via drill 1)
  other vias: 66.04,40.64
N$248  (via drill 1)
  other vias: 68.58,40.64
N$249  (via drill 1)
  other vias: 71.12,40.64
N$250  (via drill 1)
  other vias: 73.66,40.64
N$251  (via drill 1)
  other vias: 78.74,40.64
N$252  (via drill 1)
  other vias: 76.2,40.64
N$253  (via drill 1)
  other vias: 81.28,40.64
N$254  (via drill 1)
  other vias: 86.36,40.64
N$255  (via drill 1)
  other vias: 83.82,40.64
N$256  (via drill 1)
  other vias: 88.9,40.64
N$257  (via drill 1)
  other vias: 91.44,40.64
N$258  (via drill 1)
  other vias: 93.98,40.64
N$259  (via drill 1)
  other vias: 53.34,38.1
N$260  (via drill 1)
  other vias: 55.88,38.1
N$261  (via drill 1)
  other vias: 58.42,38.1
N$262  (via drill 1)
  other vias: 60.96,38.1
N$263  (via drill 1)
  other vias: 63.5,38.1
N$264  (via drill 1)
  other vias: 66.04,38.1
N$265  (via drill 1)
  other vias: 68.58,38.1
N$266  (via drill 1)
  other vias: 71.12,38.1
N$269  (via drill 1)
  other vias: 58.42,35.56
N$270  (via drill 1)
  other vias: 60.96,35.56
N$271  (via drill 1)
  other vias: 63.5,35.56
N$272  (via drill 1)
  other vias: 66.04,35.56
N$273  (via drill 1)
  other vias: 68.58,35.56
N$274  (via drill 1)
  other vias: 71.12,35.56
N$277  (via drill 1)
  other vias: 58.42,33.02
N$278  (via drill 1)
  other vias: 60.96,33.02
N$279  (via drill 1)
  other vias: 63.5,33.02
N$280  (via drill 1)
  other vias: 66.04,33.02
N$281  (via drill 1)
  other vias: 68.58,33.02
N$282  (via drill 1)
  other vias: 71.12,33.02
N$285  (via drill 1)
  other vias: 58.42,30.48
N$286  (via drill 1)
  other vias: 60.96,30.48
N$287  (via drill 1)
  other vias: 63.5,30.48
N$288  (via drill 1)
  other vias: 66.04,30.48
N$289  (via drill 1)
  other vias: 71.12,30.48
N$290  (via drill 1)
  other vias: 68.58,30.48
N$293  (via drill 1)
  other vias: 58.42,27.94
N$294  (via drill 1)
  other vias: 60.96,27.94
N$295  (via drill 1)
  other vias: 63.5,27.94
N$296  (via drill 1)
  other vias: 66.04,27.94
N$297  (via drill 1)
  other vias: 68.58,27.94
N$298  (via drill 1)
  other vias: 71.12,27.94
N$299  (via drill 1)
  other vias: 76.2,38.1
N$300  (via drill 1)
  other vias: 78.74,38.1
N$301  (via drill 1)
  other vias: 81.28,38.1
N$302  (via drill 1)
  other vias: 83.82,38.1
N$303  (via drill 1)
  other vias: 86.36,38.1
N$304  (via drill 1)
  other vias: 88.9,38.1
N$305  (via drill 1)
  other vias: 91.44,38.1
N$306  (via drill 1)
  other vias: 93.98,38.1
N$307  (via drill 1)
  other vias: 76.2,35.56
N$308  (via drill 1)
  other vias: 78.74,35.56
N$309  (via drill 1)
  other vias: 81.28,35.56
N$310  (via drill 1)
  other vias: 83.82,35.56
N$311  (via drill 1)
  other vias: 86.36,35.56
N$312  (via drill 1)
  other vias: 88.9,35.56
N$313  (via drill 1)
  other vias: 91.44,35.56
N$314  (via drill 1)
  other vias: 93.98,35.56
N$315  (via drill 1)
  other vias: 76.2,33.02
N$316  (via drill 1)
  other vias: 78.74,33.02
N$317  (via drill 1)
  other vias: 81.28,33.02
N$318  (via drill 1)
  other vias: 83.82,33.02
N$319  (via drill 1)
  other vias: 86.36,33.02
N$320  (via drill 1)
  other vias: 88.9,33.02
N$321  (via drill 1)
  other vias: 91.44,33.02
N$322  (via drill 1)
  other vias: 93.98,33.02
N$323  (via drill 1)
  other vias: 78.74,30.48
N$324  (via drill 1)
  other vias: 76.2,30.48
N$325  (via drill 1)
  other vias: 81.28,30.48
N$326  (via drill 1)
  other vias: 83.82,30.48
N$327  (via drill 1)
  other vias: 86.36,30.48
N$328  (via drill 1)
  other vias: 88.9,30.48
N$329  (via drill 1)
  other vias: 93.98,30.48
N$330  (via drill 1)
  other vias: 91.44,30.48
N$331  (via drill 1)
  other vias: 76.2,27.94
N$332  (via drill 1)
  other vias: 78.74,27.94
N$333  (via drill 1)
  other vias: 81.28,27.94
N$334  (via drill 1)
  other vias: 83.82,27.94
N$335  (via drill 1)
  other vias: 86.36,27.94
N$336  (via drill 1)
  other vias: 88.9,27.94
N$337  (via drill 1)
  other vias: 91.44,27.94
N$338  (via drill 1)
  other vias: 93.98,27.94
N$339  (via drill 1)
  other vias: 73.66,38.1
N$340  (via drill 1)
  other vias: 73.66,33.02
N$341  (via drill 1)
  other vias: 73.66,35.56
N$342  (via drill 1)
  other vias: 73.66,27.94
N$343  (via drill 1)
  other vias: 73.66,30.48
N$344  (via drill 1)
  other vias: 63.5,25.4
N$345  (via drill 1)
  other vias: 66.04,25.4
N$346  (via drill 1)
  other vias: 71.12,25.4
N$347  (via drill 1)
  other vias: 68.58,25.4
N$348  (via drill 1)
  other vias: 63.5,22.86
N$349  (via drill 1)
  other vias: 66.04,22.86
N$350  (via drill 1)
  other vias: 68.58,22.86
N$351  (via drill 1)
  other vias: 71.12,22.86
N$352  (via drill 1)
  other vias: 78.74,25.4
N$353  (via drill 1)
  other vias: 76.2,25.4
N$354  (via drill 1)
  other vias: 81.28,25.4
N$355  (via drill 1)
  other vias: 83.82,25.4
N$356  (via drill 1)
  other vias: 86.36,25.4
N$357  (via drill 1)
  other vias: 88.9,25.4
N$358  (via drill 1)
  other vias: 93.98,25.4
N$359  (via drill 1)
  other vias: 91.44,25.4
N$360  (via drill 1)
  other vias: 76.2,22.86
N$361  (via drill 1)
  other vias: 78.74,22.86
N$362  (via drill 1)
  other vias: 81.28,22.86
N$363  (via drill 1)
  other vias: 83.82,22.86
N$364  (via drill 1)
  other vias: 86.36,22.86
N$365  (via drill 1)
  other vias: 88.9,22.86
N$366  (via drill 1)
  other vias: 91.44,22.86
N$367  (via drill 1)
  other vias: 93.98,22.86
N$368  (via drill 1)
  other vias: 73.66,22.86
N$369  (via drill 1)
  other vias: 73.66,25.4
N$370  (via drill 1)
  other vias: 60.96,25.4
N$371  (via drill 1)
  other vias: 71.12,20.32
N$372  (via drill 1)
  other vias: 71.12,17.78
N$373  (via drill 1)
  other vias: 78.74,20.32
N$374  (via drill 1)
  other vias: 76.2,20.32
N$375  (via drill 1)
  other vias: 81.28,20.32
N$376  (via drill 1)
  other vias: 83.82,20.32
N$377  (via drill 1)
  other vias: 86.36,20.32
N$378  (via drill 1)
  other vias: 88.9,20.32
N$379  (via drill 1)
  other vias: 93.98,20.32
N$380  (via drill 1)
  other vias: 91.44,20.32
N$381  (via drill 1)
  other vias: 76.2,17.78
N$382  (via drill 1)
  other vias: 78.74,17.78
N$383  (via drill 1)
  other vias: 81.28,17.78
N$384  (via drill 1)
  other vias: 83.82,17.78
N$385  (via drill 1)
  other vias: 86.36,17.78
N$386  (via drill 1)
  other vias: 88.9,17.78
N$387  (via drill 1)
  other vias: 91.44,17.78
N$388  (via drill 1)
  other vias: 93.98,17.78
N$389  (via drill 1)
  other vias: 73.66,17.78
N$390  (via drill 1)
  other vias: 73.66,20.32
N$391  (via drill 1)
  other vias: 71.12,15.24
N$392  (via drill 1)
  other vias: 71.12,12.7
N$393  (via drill 1)
  other vias: 78.74,15.24
N$394  (via drill 1)
  other vias: 76.2,15.24
N$395  (via drill 1)
  other vias: 81.28,15.24
N$396  (via drill 1)
  other vias: 83.82,15.24
N$397  (via drill 1)
  other vias: 86.36,15.24
N$398  (via drill 1)
  other vias: 88.9,15.24
N$399  (via drill 1)
  other vias: 93.98,15.24
N$400  (via drill 1)
  other vias: 91.44,15.24
N$401  (via drill 1)
  other vias: 76.2,12.7
N$402  (via drill 1)
  other vias: 78.74,12.7
N$403  (via drill 1)
  other vias: 81.28,12.7
N$404  (via drill 1)
  other vias: 83.82,12.7
N$405  (via drill 1)
  other vias: 86.36,12.7
N$406  (via drill 1)
  other vias: 88.9,12.7
N$407  (via drill 1)
  other vias: 91.44,12.7
N$408  (via drill 1)
  other vias: 93.98,12.7
N$409  (via drill 1)
  other vias: 73.66,12.7
N$410  (via drill 1)
  other vias: 73.66,15.24
N$411  (via drill 1)
  other vias: 78.74,10.16
N$412  (via drill 1)
  other vias: 81.28,10.16
N$413  (via drill 1)
  other vias: 83.82,10.16
N$414  (via drill 1)
  other vias: 86.36,10.16
N$415  (via drill 1)
  other vias: 88.9,10.16
N$416  (via drill 1)
  other vias: 91.44,10.16
N$417  (via drill 1)
  other vias: 93.98,10.16
N$419  (via drill 1)
  other vias: 81.28,7.62
N$420  (via drill 1)
  other vias: 83.82,7.62
N$421  (via drill 1)
  other vias: 86.36,7.62
N$422  (via drill 1)
  other vias: 88.9,7.62
N$423  (via drill 1)
  other vias: 93.98,7.62
N$424  (via drill 1)
  other vias: 91.44,7.62
N$426  (via drill 1)
  other vias: 81.28,5.08
N$427  (via drill 1)
  other vias: 83.82,5.08
N$428  (via drill 1)
  other vias: 86.36,5.08
N$429  (via drill 1)
  other vias: 88.9,5.08
N$430  (via drill 1)
  other vias: 91.44,5.08
N$431  (via drill 1)
  other vias: 93.98,5.08
N$433  (via drill 1)
  other vias: 81.28,2.54
N$434  (via drill 1)
  other vias: 83.82,2.54
N$435  (via drill 1)
  other vias: 86.36,2.54
N$436  (via drill 1)
  other vias: 88.9,2.54
N$437  (via drill 1)
  other vias: 91.44,2.54
N$438  (via drill 1)
  other vias: 93.98,2.54
N$439
  pour Top (isolate 0.406): 0,0 0,80 100,80 100,0
N$440
  pour Bottom (isolate 0.406): 0,80 0,0 100,0 100,80
PB0  (via drill 0.6)
  Top 0.254: IC1.14 20.67,42.77 17.1,39.2 v16.5,39.2
  Bottom 0.254: USBPUD.3 18.31,30.19 16.7,31.8 16.7,39 v16.5,39.2
PB1  (via drill 0.6)
  Top 0.254: IC1.15 28.29,42.81 28.3,42.8 26.8,41.3 v21.1,41.3
  Bottom 0.254: SPK.1 22.8,35.1 21.1,36.8 v21.1,41.3 | IC1.15 29.9,42.9 33.4,46.4 46.2,46.4 47.1,45.5 47.1,36.2 47.3,36 47.32,36 DFCS.1
PB2  (via drill 0.6)
  Top 0.254: v25.8,51.8 19,51.8 18.3,52.5 9.5,52.5 8.6,51.6 8.62,51.58 ROUT.2 | IC1.16 28.29,45.49 28.3,45.5 v25.7,45.5
  Bottom 0.254: v25.7,45.5 25.5,45.7 25.5,51.4 25.8,51.7 v25.8,51.8
PB3  (via drill 0.6)
  Top 0.254: MOSI.2 12.56,41.46 14.2,43.1 18.2,43.1 19.3,44.2 v26.2,44.2 | FET3.2 36.98,52.6 37,52.6 37,52 35.7,50.7 35.7,49.5 35.2,49 34,49 33,50 31.5,50 29.5,48 28.2,48 28.2,47.99 IC1.17 | v31.4,22.7 v34.1,22.7 | v39.9,26.6 39.9,26.4 40.7,25.6 45.2,25.6 46,26.4 46,27.2 46.6,27.8 50.1,27.8 50.7,27.2 52.1,27.2 52.1,27.19 IC4.1
  Bottom 0.254: IC1.17 28.2,47.99 28.2,48 27.1,48 26.6,47.5 26.6,44.6 v26.2,44.2 26.2,44.1 26.4,43.9 26.4,42 31.4,37 v31.4,22.7 | v34.1,22.7 34.1,22.9 36.8,25.6 38.9,25.6 v39.9,26.6
PB4  (via drill 0.6)
  Top 0.254: MISO.2 12.78,44.02 v12.8,44 | v12.8,51.5 13.7,51.5 16,49.2 26.3,49.2 27.6,50.5 28.2,50.5 28.23,50.53 IC1.18 | IC4.8 52.17,34.33 51.9,34.6 49.2,34.6 48.9,34.9 48.9,44.6 45,48.5 v45,49
  Bottom 0.254: v12.8,44 v12.8,51.5 | IC1.18 30.27,50.53 30.8,50 30.8,48.3 31.8,47.3 44.3,47.3 44.7,47.7 44.7,48.6 45,48.9 v45,49
PB5  (via drill 0.6)
  Top 0.254: SCK.2 11.84,46.54 v11.9,46.6 | v11.9,53.6 18.6,53.6 19.3,54.3 26.4,54.3 27.6,53.1 28.3,53.1 28.29,53.09 IC1.19 | IC4.2 53.4,27.19 53.4,27.2 53.5,27.3 53.5,28.9 52.9,29.5 50.5,29.5 48.4,31.6 48.4,44.4 46,46.8 44.6,48.2 v43.8,48.2
  Bottom 0.254: v11.9,46.6 v11.9,53.6 | IC1.19 30.03,53.07 31.4,51.7 31.4,48.5 31.7,48.2 v43.8,48.2
PC0
  Top 0.254: S1.2 62.46,72.94 61.3,74.1 48.6,74.1 46.4,71.9 44.8,71.9 44.4,71.5 44.4,69.7 43.3,68.6 40.3,68.6 39.3,67.6 39.3,67.1 37.3,65.1 30.1,65.1 28.3,63.3 28.29,63.3 IC1.23
PC1
  Top 0.254: S2.2 72.46,71.94 69.5,74.9 48.6,74.9 46.1,72.4 43.2,72.4 41.6,70.8 40.9,70.8 38.6,68.5 37.3,68.5 36.7,67.9 36.7,66.6 35.9,65.8 28.29,65.8 IC1.24
PC2
  Top 0.254: IC1.25 35.81,68.31 36.6,69.1 36.6,70.4 37.4,71.2 38.6,71.2 40.7,73.3 46.2,73.3 48.4,75.5 78.9,75.5 82.7,71.7 82.7,71.69 S3.2
PC3
  Top 0.254: S4.2 92.4,71.74 92.4,71.7 88,76.1 47.9,76.1 45.7,73.9 37.3,73.9 36.5,73.1 36.5,71.5 36.1,71.1 28.5,71.1 28.2,70.8 IC1.26
  Bottom 0.254: IRRX.2 25.32,33.02 26,33.7 27,33.7 27.5,34.2 27.5,35.7 24.2,39 24.2,44.4 24.8,45 24.8,53.8 25.7,54.7 25.7,70.3 26.2,70.8 28.1,70.8 28.2,70.9 28.25,70.85 IC1.26
PC4
  Top 0.254: LED1.1 35.3,75 33.69,73.39 IC1.27
PC5
  Top 0.254: POTI.1 35.3,77.59 35.2,77.5 33.63,75.93 IC1.28
PD0
  Bottom 0.254: RX.2 26.46,35.44 23.4,38.5 23.4,44.8 24.2,45.6 24.2,54.3 23.4,55.1 23.4,72.8 22.8,73.4 20.7,73.4 20.69,73.39 IC1.2
PD1
  Bottom 0.254: IC1.3 20.75,70.85 20.8,70.8 21.7,70.8 22.4,70.1 22.4,36.4 TX.2 | TX.2 23.9,34.9 | TX.2
PD2
  Bottom 0.254: IC1.4 20.69,68.31 20.7,68.3 19.1,68.3 18.4,67.6 18.4,55.2 17.9,54.7 17.9,42.2 18.4,41.7 18.4,35.4 D+.2
PD3  (via drill 0.6)
  Top 0.254: IC1.5 22.83,65.77 v24.5,64.1 26.5,62.1 36.7,62.1 v38.6,64 | LED2.1 35.4,72.42 35.4,72.4 35,72 v24.5,72
  Bottom 0.254: v24.5,64.1 v24.5,72 | FET4.2 42.06,52.7 42.1,52.7 38.6,56.2 v38.6,64
PD4
  Bottom 0.254: D-.2 21.13,34.97 18.9,37.2 18.9,41.9 18.4,42.4 18.4,54.5 19,55.1 19,61.6 20.63,63.23 IC1.6
PD5  (via drill 0.6)
  Top 0.254: v20.1,39.6 v25.7,39.6 | IC1.11 20.7,50.5 25.9,50.5 27.2,51.8 33.6,51.8 34.4,52.6 FET2.2 34.4,52.8
  Bottom 0.254: IRTX.1 27.9,33.5 28.1,33.7 28.1,37.2 v25.7,39.6 | v20.1,39.6 20.1,41.4 18.9,42.6 18.9,49.7 19.8,50.6 20.5,50.6 20.6,50.5 20.63,50.53 IC1.11
PD6
  Top 0.254: IC1.12 25.99,47.99 27.3,49.3 29.2,49.3 31.2,51.3 33.9,51.3 34,51.4 35,51.4 35.7,52.1 35.7,53.3 36.3,53.9 38.3,53.9 39.4,52.8 39.52,52.7 FET1.2 39.52,52.5 39.5,52.5
  Bottom 0.254: LED3.1 35.35,69.75 36.7,68.4 36.7,55.5 39.5,52.7 39.52,52.7 FET1.2
PD7  (via drill 0.6)
  Top 0.254: IC1.13 23.95,45.45 25.3,46.8 30,46.8 v32.3,49.1
  Bottom 0.254: LED4.1 35.4,67.26 35.4,67.3 32.3,64.2 v32.3,49.1
PUD
  Bottom 0.254: 24.5,20.8 R13.1 23.6,20.8 22.5,21.9 20,21.9 19.4,22.5 19.4,25 18.3,26.1 USBPUD.2
RESET
  Bottom 0.254: RIN.2 8.7,54.3 10.7,56.3 10.7,74.7 | RESET.1 7.2,74.68 7.2,74.7 10.7,74.7 | 10.7,74.7 12.3,76.3 19.9,76.3 20.5,75.9 20.53,75.93 IC1.1
RX  (via drill 0.6)
  Top 0.254: v26.6,24.1 27,24.5 v37,24.5
  Bottom 0.254: 26.5,32.4 26.49,32.39 RX.1 26.46,32.34 26.6,32.2 v26.6,24.1 | IC3.12 46.6,14.65 46.6,14.6 46.5,14.7 46.5,17.3 45.3,18.5 45.3,23.8 44.3,24.8 37.5,24.8 v37,24.5
SD1
  Bottom 0.254: X1.1 53.14,6.74 51.3,8.7 51.3,10.2 51.2,10.3 SV1.1
SD4
  Bottom 0.254: X1.4 44.91,2.29 45.5,1.7 52.6,1.7 53.2,2.3 53.2,3.2 52,4.4 52,6.2 48.7,9.5 48.7,10.3 SV1.2 48.8,10.3
SD6
  Bottom 0.254: X1.6 51.67,2.83 51.5,3 51.5,6 50.3,7.2 46.8,7.2 46.2,7.8 46.2,10.3 SV1.3
SD7
  Top 0.254: SV1.4 43.68,5.02 44.7,4 47.8,4 49.1,2.7 49.02,2.8 X1.7
SD8
  Top 0.254: X1.8 45.17,2.83 43.8,4.2 41.5,4.2 41,4.7 41,10.2 41.1,10.3 SV1.5
SD9
  Top 0.254: X1.9 41.17,2.83 40.5,3.5 40.5,6.7 38.6,8.6 SV1.6
TX  (via drill 0.6)
  Top 0.254: v36.1,23.6 27.6,23.6 27.1,23.1 24.9,23.1 v24.1,23.9
  Bottom 0.254: TX.1 23.88,25.12 24.1,24.9 v24.1,23.9 | 44,14.6 IC3.11 43.95,15.9 | 43.95,15.9 43.95,15.95 | v36.1,23.6 37.7,23.5 38.2,24 42.2,24 42.6,23.6 42.6,17.3 44,15.9 43.95,15.9
VCCEXT
  Bottom 0.813: D1.A 4.4,27.7 | IC2.OUT 4.4,26.82 4.4,27.7 | 4.4,27.7 4.4,28.7 7.5,31.8 7.6,31.72 PWRSEL.1 10.18,31.72 11.4,30.5 11.4,30.51 C7.1
VCCUSB
  Top 0.813: USB.1 20.25,7.05 17.8,9.5 17.8,21.9 16.3,23.4 16.3,30.9 15,32.2 12.1,32.2 11.2,33.1 11.2,34.7 9.1,36.8 8,36.8 7.9,36.7 7.8,36.8 PWRSEL.3

### Text on the board
Bottom: rumpus v2 | GND | GND | GND | GND | 5V | 5V
tPlace: rumpus v2 | GND | GND | GND | GND | RST | MOSI | SCK | 5V | VCC | MISO | 1 | 5V | usb | vcc | ext